# Altium schematic sheet 5V_Outputs.SchDoc: RP2040 CNC
size B; Author: AM; CompanyName: Expatria Technologies; DrawnBy: A.Marles; Engineer: AM; Organization: Expatria Technolgoies; DocumentNumber: 4; SheetNumber: 5; SheetTotal: 9
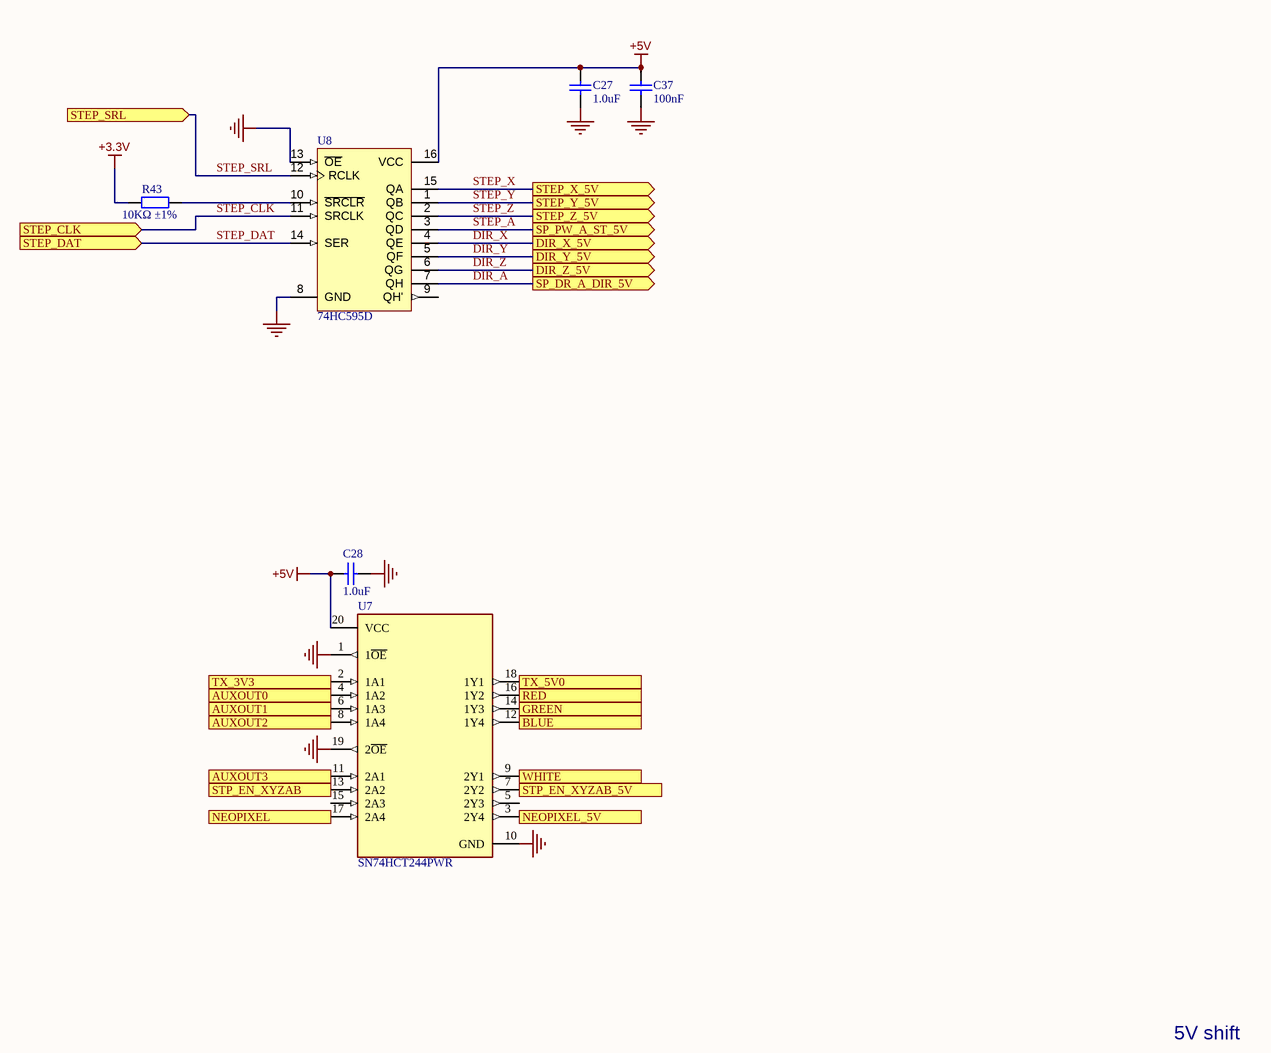
[diagram p0: 5V_Outputs.SchDoc]

## Parts
C27  1.0uF  [0402_C]
C28  1.0uF  [0402_C]
C37  100nF  [0402_C]
R43  10KΩ ±1%  [0402_R]
U7  SN74HCT244PWR  [FP-PW0020A-IPC_B]
U8  74HC595D  [SOIC-16_150mil]

## Ports
AUXOUT0 (in), AUXOUT1 (in), AUXOUT2 (in), AUXOUT3 (in), BLUE (out), DIR_X_5V (out), DIR_Y_5V (out), DIR_Z_5V (out), GREEN (out), NEOPIXEL (in), NEOPIXEL_5V (out), RED (out), SP_DR_A_DIR_5V (out), SP_PW_A_ST_5V (out), STEP_CLK (in), STEP_DAT (in), STEP_SRL (in), STEP_X_5V (out), STEP_Y_5V (out), STEP_Z_5V (out), STP_EN_XYZAB (in), STP_EN_XYZAB_5V (out), TX_3V3 (in), TX_5V0 (out), WHITE (out)

## Nets
+3.3V: R43.2
+5V: C27.2 C28.1 C37.2 U7.20(VCC) U8.16(VCC)
GND: C27.1 C28.2 C37.1 U7.1(1~{OE}) U7.10(GND) U7.19(2~{OE}) U8.8(GND) U8.13(~{OE})
AUXOUT0: U7.4(1A2) ; port AUXOUT0
AUXOUT1: U7.6(1A3) ; port AUXOUT1
AUXOUT2: U7.8(1A4) ; port AUXOUT2
AUXOUT3: U7.11(2A1) ; port AUXOUT3
BLUE: U7.12(1Y4) ; port BLUE
DIR_A: U8.7(QH) ; port SP_DR_A_DIR_5V
DIR_X: U8.4(QE) ; port DIR_X_5V
DIR_Y: U8.5(QF) ; port DIR_Y_5V
DIR_Z: U8.6(QG) ; port DIR_Z_5V
GREEN: U7.14(1Y3) ; port GREEN
NEOPIXEL: U7.17(2A4) ; port NEOPIXEL
NEOPIXEL_5V: U7.3(2Y4) ; port NEOPIXEL_5V
RED: U7.16(1Y2) ; port RED
STEP_A: U8.3(QD) ; port SP_PW_A_ST_5V
STEP_CLK: U8.11(SRCLK) ; port STEP_CLK
STEP_DAT: U8.14(SER) ; port STEP_DAT
STEP_SRL: U8.12(RCLK) ; port STEP_SRL
STEP_X: U8.15(QA) ; port STEP_X_5V
STEP_Y: U8.1(QB) ; port STEP_Y_5V
STEP_Z: U8.2(QC) ; port STEP_Z_5V
STP_EN_XYZAB: U7.13(2A2) ; port STP_EN_XYZAB
STP_EN_XYZAB_5V: U7.7(2Y2) ; port STP_EN_XYZAB_5V
TX_3V3: U7.2(1A1) ; port TX_3V3
TX_5V0: U7.18(1Y1) ; port TX_5V0
WHITE: U7.9(2Y1) ; port WHITE
NetR43_1: R43.1 U8.10(~{SRCLR})

Not connected (* = marked no-connect by the designer): U7 5(2Y3) 15(2A3); U8 9(QH')

## Notes on the sheet
- 5V shift
- SHEET
- Expatria Technologies
- 1136 Glade Court
- Port Coquitlam, BC V3B 1R5
- PROJECT
- SIZE
- ENGR
- MODIFIED
- DOCUMENT
- REV
- Copyright Expatria Technologies 2023. This document describes Open Hardware and is licensed under the CERN-OHL-S v2. No warranty is implied or expressed.
- EMAIL: INFO@EXPATRIA.CA
- B
- /

## Library data of the parts
C27 C28 = 0402 1.0uF (105) 10% 25V: Chip capacitor; Manufacturer: Samsung Electro-Mechanics; PartNumber: CL05A105KA5NQNC; Capacitance: 1uF; Tolerance: 10%; Voltage: 25V; ComponentLink1Description: Supplier link; ComponentLink1URL: http://www.szlcsc.com/product/details_53938.html; Package: 0402; Supplier: LC; SuppliersPartNumber: C52923
C37 = 0402 100nF (104) 10% 16V: Chip capacitors; Manufacturer: Samsung Electro-Mechanics; PartNumber: CL05B104KO5NNNC; Tolerance: 10%; Voltage: 16V; ComponentLink1Description: Supplier link; ComponentLink1URL: http://www.szlcsc.com/product/details_1877.html; Package: 0402; Supplier: LC; SuppliersPartNumber: C1525; Capacitance: 100nF
R43 = 0402 10K (1002) 1%: Chip resistor; Manufacturer: Uniroyal Elec; PartNumber: 0402WGF1002TCE; Power: 1/16W; ComponentLink1Description: Supplier link; ComponentLink1URL: http://www.szlcsc.com/product/details_26487.html; Package: 0402; Supplier: LC; SuppliersPartNumber: C25744; Resistance: 10KΩ; Tolerance: 1%
U7 = CMP-0440-01235-4: IC BUF NON-INVERT 5.5V 20TSSOP; Number of Input Lines: 8; Number of Bits per Element: 4; Number of Elements: 2; Low Level Output Current: 6mA; High Level Output Current: -6mA; Propagation Delay: 40ns; Operating Supply Voltage: 5V; Polarity: Non-Inverting; Min Supply Voltage: 4.5V; Logic Function: Buffer; Turn-On Delay Time: 65ns; Quiescent Current: 8uA; Output Type: 3-STATE; Max Supply Voltage: 5.5V; Series: 74HCT; REACH SVHC: No SVHC; Package Quantity: 2000; Contact Plating: Gold; Technology: CMOS; Number of Channels: 8; RoHS Compliant: Yes; Lead Free: Lead Free; Number of Outputs: 8; Length: 6.5mm; Packaging: Tape and Reel; Min Operating Temperature: -40°C; Mount: Surface Mount; Width: 4.4mm; Height: 1.15mm; Radiation Hardening: No; Number of Inputs: 8; Max Operating Temperature: 85°C; Number of Output Lines: 8; Case/Package: TSSOP; Number of Bits: 8; Number of Pins: 20; SuppliersPartNumber: C131088
U8 = 74HC595D_[C5947]: 8 bit serial in or parallel out shift register; ComponentLink1Description: 供应商链接; ComponentLink1URL: http://www.szlcsc.com/product/details_6413.html; Package: SOIC-16_150mil; Supplier: LC; SuppliersPartNumber: C5947